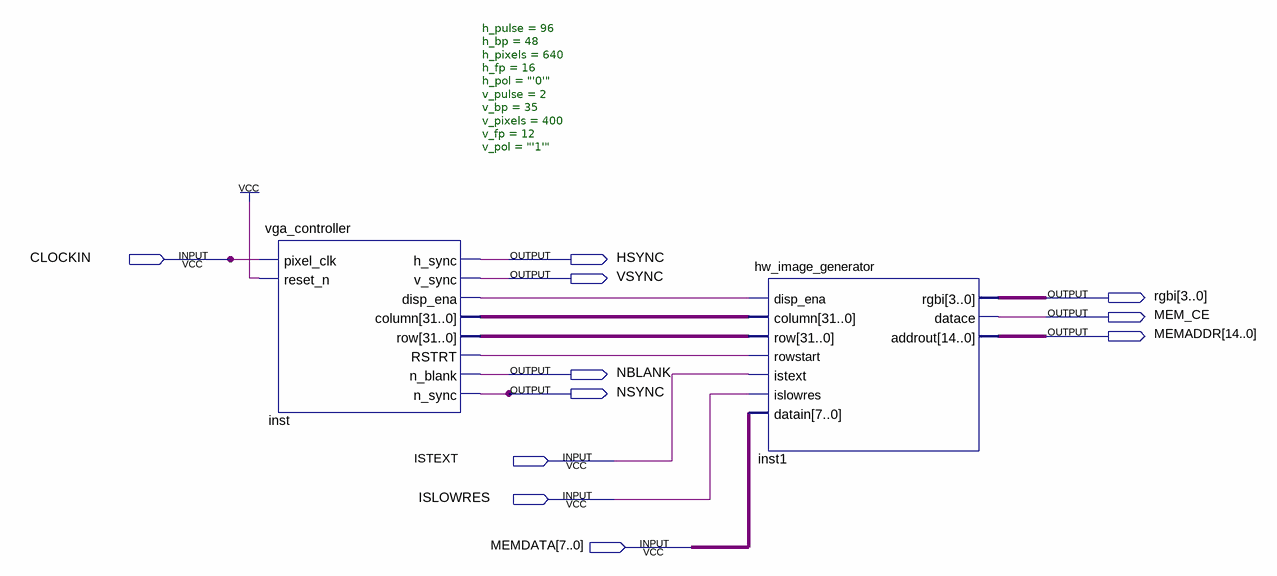
[diagram p0: schematic sheet]
// Quartus schematic BLKDSGN.bdf as structural Verilog: 2 symbols, 11 pins
module BLKDSGN (
  input  CLOCKIN,
  input  ISTEXT,
  input  ISLOWRES,
  input  [7:0] MEMDATA,
  output HSYNC,
  output VSYNC,
  output [3:0] rgbi,
  output MEM_CE,
  output [14:0] MEMADDR,
  output NBLANK,
  output NSYNC
);

  wire inst_disp_ena, inst_rstrt;
  wire [31:0] inst_column, inst_row;

  vga_controller #(.h_pulse(96), .h_bp(48), .h_pixels(640), .h_fp(16), .h_pol("'0'"), .v_pulse(2), .v_bp(35), .v_pixels(400), .v_fp(12), .v_pol("'1'")) inst (
    .pixel_clk(CLOCKIN), .reset_n(1'b1), .h_sync(HSYNC), .v_sync(VSYNC), .disp_ena(inst_disp_ena),
    .column(inst_column), .row(inst_row), .RSTRT(inst_rstrt), .n_blank(NBLANK), .n_sync(NSYNC));
  hw_image_generator inst1 (
    .disp_ena(inst_disp_ena), .column(inst_column), .row(inst_row), .rowstart(inst_rstrt), .istext(ISTEXT),
    .islowres(ISLOWRES), .datain(MEMDATA), .rgbi(rgbi), .datace(MEM_CE), .addrout(MEMADDR));
endmodule
